# Altium schematic sheet [2]-MCU.SchDoc
size A
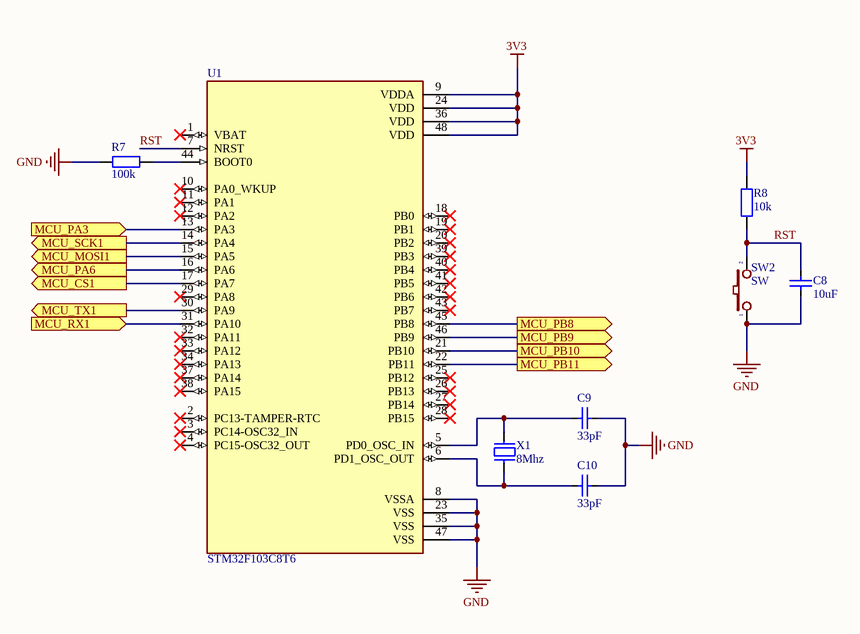
[diagram p0: [2]-MCU.SchDoc]

## Parts
C8  10uF  [CAP_0805]
C9  33pF  [CAP_0805]
C10  33pF  [CAP_0805]
R7  100k  [RES-SMD-0805]
R8  10k  [RES-SMD-0805]
SW2  SW  [SW-SMD]
U1  STM32F103C8T6  [QFP50P900X900X160-48N]
X1  8Mhz  [X2-SMD-5.0X3.2X1.3MM]

## Ports
MCU_CS1 (out), MCU_MOSI1 (out), MCU_PA3 (in), MCU_PA6 (out), MCU_PB8 (out), MCU_PB9 (out), MCU_PB10 (out), MCU_PB11 (out), MCU_RX1 (in), MCU_SCK1 (out), MCU_TX1 (out)

## Nets
3V3: R8.1 U1.9(VDDA) U1.24(VDD) U1.36(VDD) U1.48(VDD)
GND: C8.1 C9.2 C10.2 R7.1 SW2.1 U1.8(VSSA) U1.23(VSS) U1.35(VSS) U1.47(VSS)
MCU_CS1: U1.17(PA7) ; port MCU_CS1
MCU_MOSI1: U1.15(PA5) ; port MCU_MOSI1
MCU_PA3: U1.13(PA3) ; port MCU_PA3
MCU_PA6: U1.16(PA6) ; port MCU_PA6
MCU_PB8: U1.45(PB8) ; port MCU_PB8
MCU_PB9: U1.46(PB9) ; port MCU_PB9
MCU_PB10: U1.21(PB10) ; port MCU_PB10
MCU_PB11: U1.22(PB11) ; port MCU_PB11
MCU_RX1: U1.31(PA10) ; port MCU_RX1
MCU_SCK1: U1.14(PA4) ; port MCU_SCK1
MCU_TX1: U1.30(PA9) ; port MCU_TX1
RST: C8.2 R8.2 SW2.2 U1.7(NRST)
NetC9_1: C9.1 U1.5(PD0_OSC_IN) X1.2
NetC10_1: C10.1 U1.6(PD1_OSC_OUT) X1.1
NetR7_2: R7.2 U1.44(BOOT0)

Not connected (* = marked no-connect by the designer): U1 1(VBAT)* 2(PC13-TAMPER-RTC)* 3(PC14-OSC32_IN)* 4(PC15-OSC32_OUT)* 10(PA0_WKUP)* 11(PA1)* 12(PA2)* 18(PB0)* 19(PB1)* 20(PB2)* 25(PB12)* 26(PB13)* 27(PB14)* 28(PB15)* 29(PA8)* 32(PA11)* 33(PA12)* 34(PA13)* 37(PA14)* 38(PA15)* 39(PB3)* 40(PB4)* 41(PB5)* 42(PB6)* 43(PB7)*

## Library data of the parts
C8-C10 = CapSMD: Capacitor; Value: 33p; Published: 8-Jun-2000; LatestRevisionDate: 17-Jul-2002; LatestRevisionNote: Re-released for DXP Platform.; PackageReference: RAD-0.3; Publisher: Altium Limited
R7 R8 = Resistor - SMD: Resistor SMD; Manufacturer: Generic Components; Class: Passive; Published: 08/06/2000; Publisher: Altium Hobart Technology Centre
SW2 = SW2: Switch button 2 pin; Value: SW chip 2 pin
U1 = STM32F103C8T6: ARMÂ® CortexÂ®-M3 STM32F1 Microcontroller IC 32-Bit 72MHz 64KB (64K x 8) FLASH 48-LQFP (7x7); MF: STMicroelectronics; Price: None; Availability: In Stock; MP: STM32F103C8T6; Package: LQFP-48 STMicroelectronics; SnapEDA_Link: https://www.snapeda.com/parts/STM32F103C8T6/STMicroelectronics/view-part/?ref=snap; Check_prices: https://www.snapeda.com/parts/STM32F103C8T6/STMicroelectronics/view-part/?ref=eda; Value: *; Purchase-URL: https://pricing.snapeda.com/search/part/STM32F103C8T6/?ref=eda
X1 = XT2: Crystal For all Crystal 2pin.; Value: 4Mhz